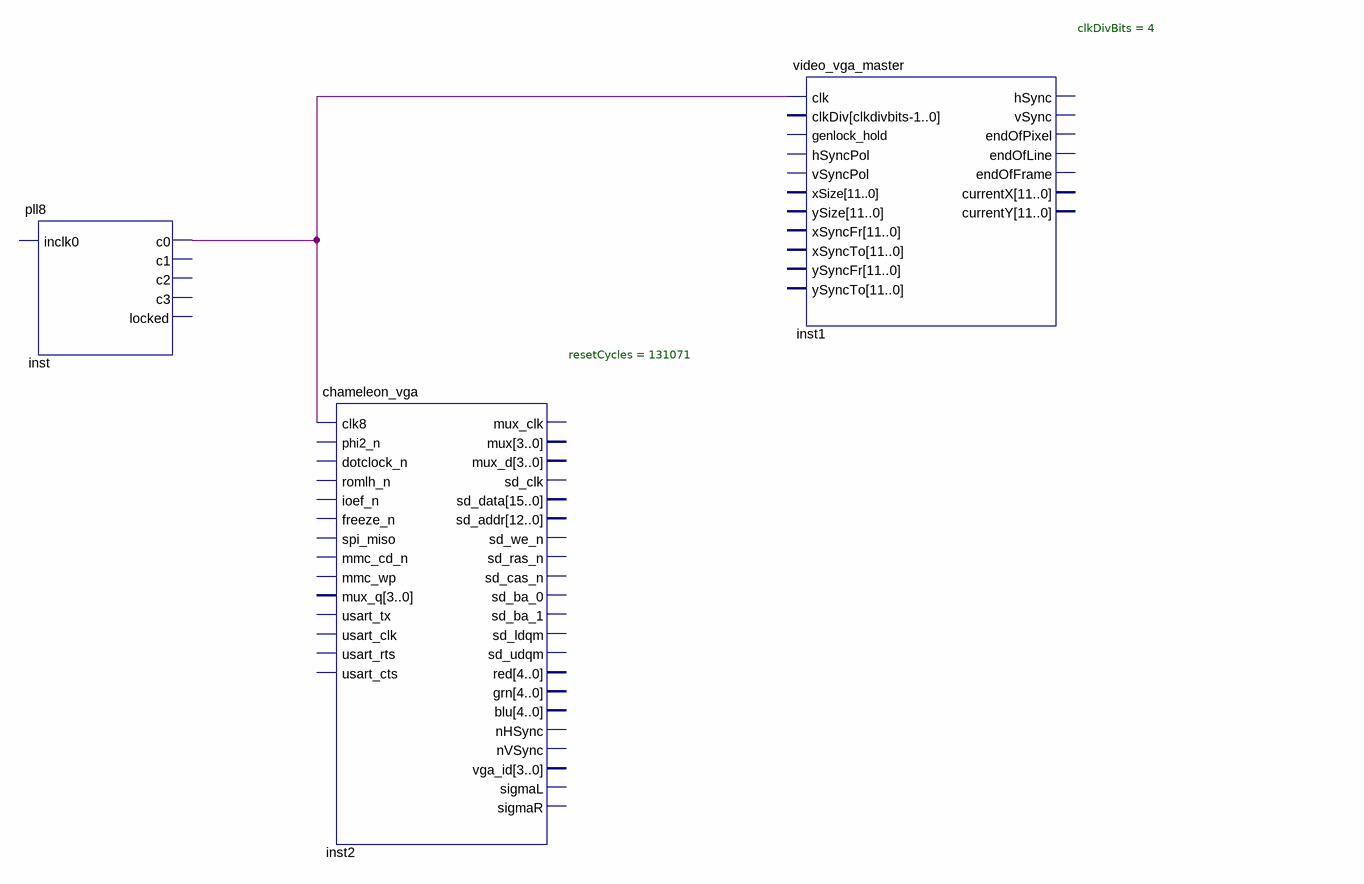
[diagram p0: schematic sheet]
// Quartus schematic Block1.bdf as structural Verilog: 3 symbols, 0 pins
module Block1 (
);

  wire inst_c0;

  pll8 inst (.c0(inst_c0));  // open: inclk0, c1, c2, c3, locked
  chameleon_vga #(.resetCycles(131071)) inst2 (.clk8(inst_c0));  // open: phi2_n, dotclock_n, romlh_n, ioef_n, freeze_n, spi_miso, mmc_cd_n, mmc_wp, mux_q, usart_tx, usart_clk, usart_rts, usart_cts, mux_clk, mux, mux_d, sd_clk, sd_addr, sd_we_n, sd_ras_n, sd_cas_n, sd_ba_0, sd_ba_1, sd_ldqm, sd_udqm, red, grn, blu, nHSync, nVSync, vga_id, sigmaL, sigmaR, sd_data
  video_vga_master #(.clkDivBits(4)) inst1 (.clk(inst_c0));  // open: clkDiv, genlock_hold, hSyncPol, vSyncPol, xSize, ySize, xSyncFr, xSyncTo, ySyncFr, ySyncTo, hSync, vSync, endOfPixel, endOfLine, endOfFrame, currentX, currentY
endmodule
